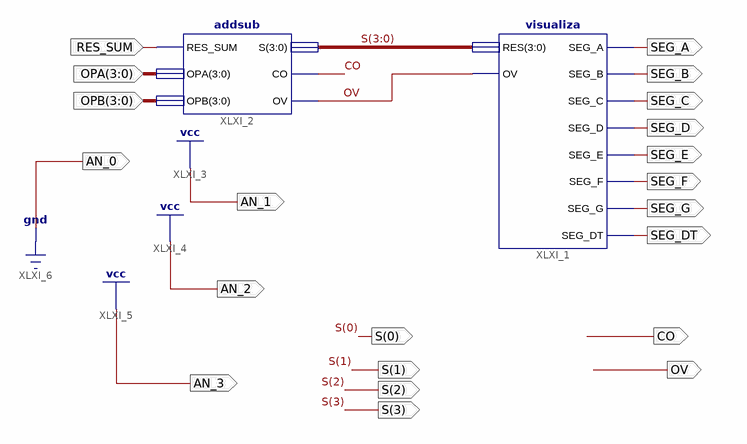
[diagram p0: schematic sheet 1]
// Xilinx ISE schematic top_addsub.sch (spartan3e) as structural Verilog: 2 symbols, 21 ports
module top_addsub (
  input  RES_SUM,
  input  [3:0] OPA,
  input  [3:0] OPB,
  output SEG_A,
  output SEG_B,
  output SEG_C,
  output SEG_D,
  output SEG_E,
  output SEG_F,
  output SEG_G,
  output SEG_DT,
  output OV,
  output CO,
  output AN_1,
  output AN_2,
  output AN_3,
  output AN_0,
  output [3:0] S
);

  visualiza XLXI_1 (
    .OV(OV), .RES(S), .SEG_A(SEG_A), .SEG_B(SEG_B), .SEG_C(SEG_C), .SEG_D(SEG_D), .SEG_DT(SEG_DT),
    .SEG_E(SEG_E), .SEG_F(SEG_F), .SEG_G(SEG_G));
  addsub XLXI_2 (.CO(CO), .OPA(OPA), .OPB(OPB), .OV(OV), .RES_SUM(RES_SUM), .S(S));

  assign AN_0 = 1'b0;
  assign AN_1 = 1'b1;
  assign AN_2 = 1'b1;
  assign AN_3 = 1'b1;
endmodule
